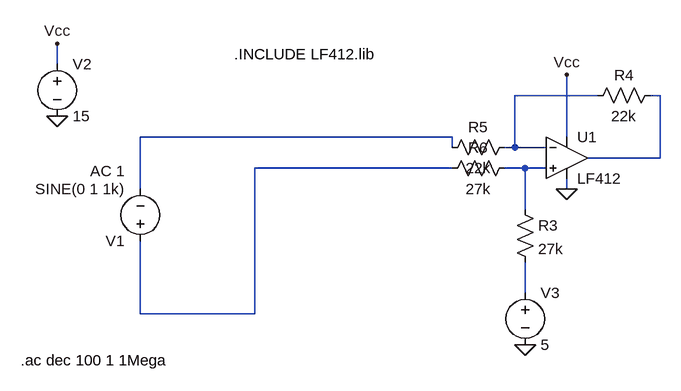
[diagram p0: schematic entrada_balanceada.asc]
entrada_balanceada.asc, the LTspice schematic file:
Version 4
SHEET 1 880 680
WIRE -1392 32 -1392 0
WIRE -560 80 -688 80
WIRE -464 80 -480 80
WIRE -784 144 -1264 144
WIRE -608 144 -608 48
WIRE -784 160 -784 144
WIRE -688 160 -688 80
WIRE -688 160 -704 160
WIRE -640 160 -688 160
WIRE -464 176 -464 80
WIRE -464 176 -576 176
WIRE -784 192 -1088 192
WIRE -672 192 -704 192
WIRE -640 192 -672 192
WIRE -1264 224 -1264 144
WIRE -608 224 -608 208
WIRE -672 256 -672 192
WIRE -672 384 -672 336
WIRE -1264 416 -1264 304
WIRE -1088 416 -1088 192
WIRE -1088 416 -1264 416
FLAG -1392 112 0
FLAG -1392 0 Vcc
FLAG -608 48 Vcc
FLAG -608 224 0
FLAG -672 464 0
SYMBOL voltage -1264 320 R180
WINDOW 123 24 124 Left 2
WINDOW 39 0 0 Left 2
SYMATTR Value2 AC 1
SYMATTR InstName V1
SYMATTR Value SINE(0 1 1k)
SYMBOL voltage -1392 16 R0
SYMATTR InstName V2
SYMATTR Value 15
SYMBOL res -688 240 R0
SYMATTR InstName R3
SYMATTR Value 27k
SYMBOL res -464 64 R90
WINDOW 0 0 56 VBottom 2
WINDOW 3 32 56 VTop 2
SYMATTR InstName R4
SYMATTR Value 22k
SYMBOL res -688 144 R90
WINDOW 0 0 56 VBottom 2
WINDOW 3 32 56 VTop 2
SYMATTR InstName R5
SYMATTR Value 22k
SYMBOL res -688 176 R90
WINDOW 0 0 56 VBottom 2
WINDOW 3 32 56 VTop 2
SYMATTR InstName R6
SYMATTR Value 27k
SYMBOL voltage -672 368 R0
SYMATTR InstName V3
SYMATTR Value 5
SYMBOL Opamps\\opamp2 -608 112 R0
SYMATTR InstName U1
SYMATTR Value LF412
TEXT -1448 488 Left 2 !.ac dec 100 1 1Mega
TEXT -1120 16 Left 2 !.INCLUDE LF412.lib

The netlist it stands for:
* entrada_balanceada.asc
V1 N004 N003 SINE(0 1 1k) AC 1
V2 Vcc 0 15
R3 N005 N006 27k
R4 N002 N001 22k
R5 N001 N003 22k
R6 N005 N004 27k
V3 N006 0 5
XU1 N005 N001 Vcc 0 N002 LF412  ; pins In+ In- V+ V- OUT
.ac dec 100 1 1Mega
.INCLUDE LF412.lib
.backanno
.end